# Altium schematic sheet Keypadmacro.SchDoc
size 419 x 297 mm
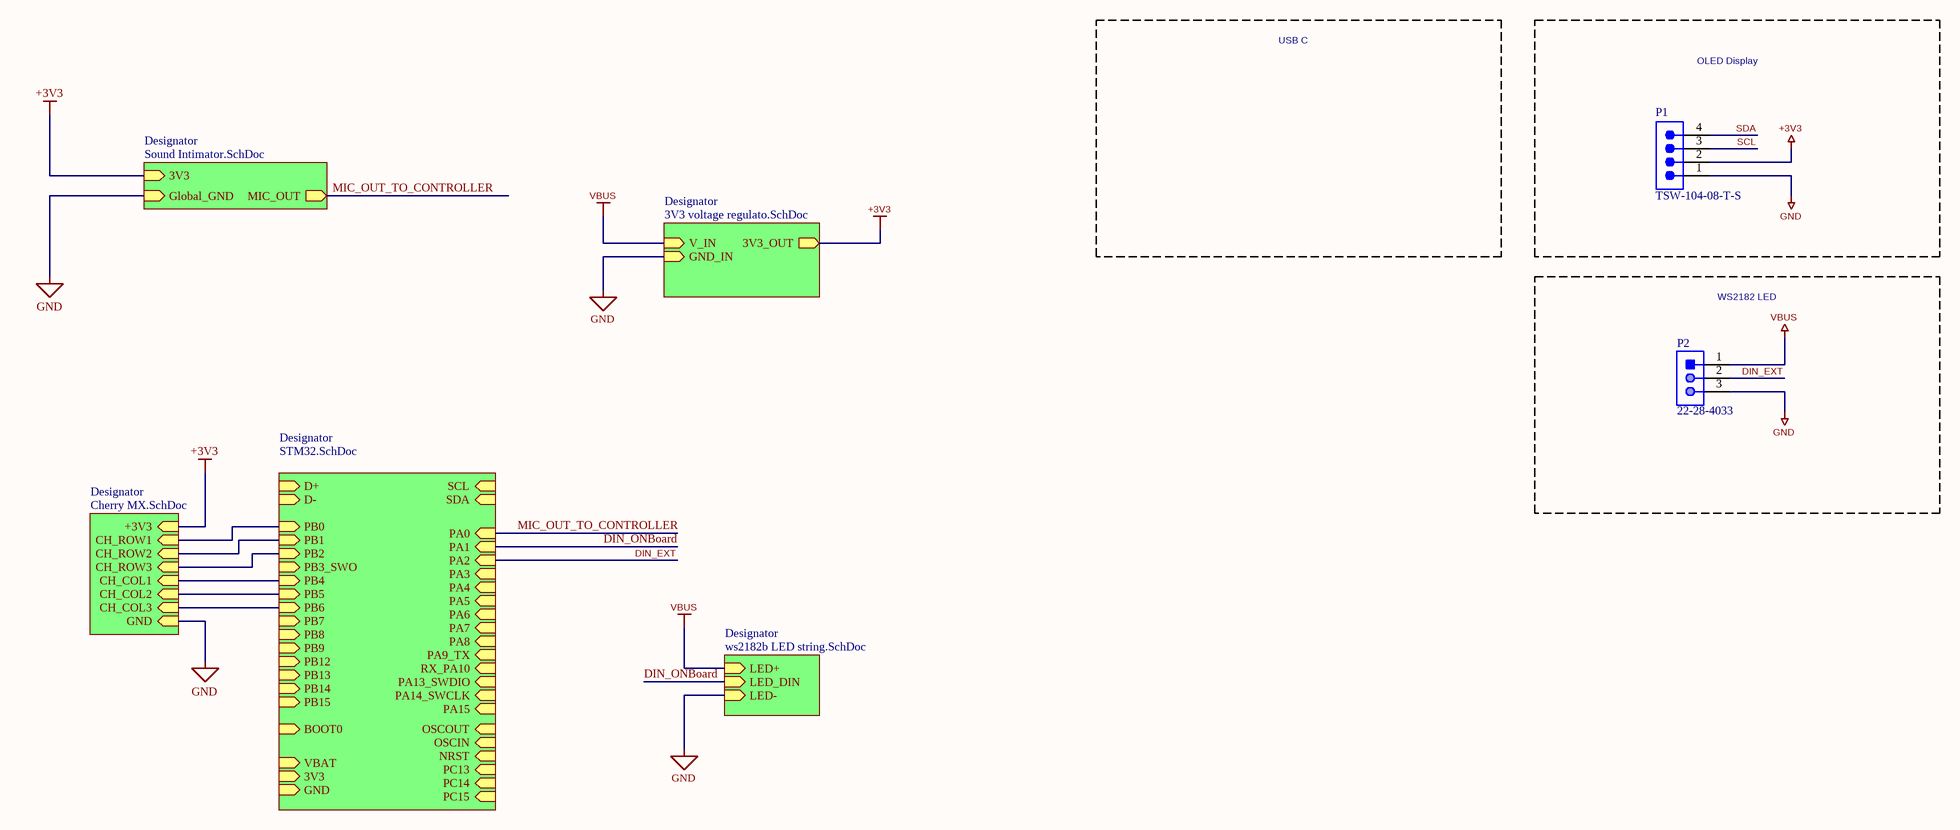
[diagram p0: Keypadmacro.SchDoc]

## Parts
P1  TSW-104-08-T-S  [SMTC-TSW-104-08-X-S]
P2  22-28-4033  [MOLX-22-28-4033_V]

## Blocks framed on the sheet
OLED Display: P1
WS2182 LED: P2

## Sub-sheets
Designator = Sound Intimator.SchDoc: 3V3 (in), Global_GND (in), MIC_OUT (out)
Designator = STM32.SchDoc: 3V3 (in), VBAT (in), GND (in), D+ (in), D- (in), BOOT0 (in), NRST (in), PA0 (in), PA9_TX (in), PA6 (in), PA7 (in), PA1 (in), PA5 (in), PA3 (in), PA2 (in), PA4 (in), PA8 (in), PB13 (in), PB6 (in), PB9 (in), PB12 (in), PB14 (in), PB0 (in), PB4 (in), PB3_SWO (in), PB1 (in), PB8 (in), PB15 (in), PB5 (in), PB2 (in), PB7 (in), RX_PA10 (in), PC14 (in), PC15 (in), PA15 (in), PC13 (in), SCL (in), OSCIN (in), SDA (in), PA13_SWDIO (in), PA14_SWCLK (in), OSCOUT (in)
Designator = Cherry MX.SchDoc: CH_ROW2 (in), CH_COL3 (in), CH_ROW3 (in), GND (in), +3V3 (in), CH_COL2 (in), CH_ROW1 (in), CH_COL1 (in)
Designator = 3V3 voltage regulato.SchDoc: 3V3_OUT (out), GND_IN (in), V_IN (in)
Designator = ws2182b LED string.SchDoc: LED+ (in), LED_DIN (in), LED- (in)

## Nets
+3V3: P1.2 ; sheet Designator/3V3, sheet Designator/+3V3, sheet Designator/3V3_OUT
GND: P1.1 P2.3 ; sheet Designator/Global_GND, sheet Designator/GND, sheet Designator/GND_IN, sheet Designator/LED-
VBUS: P2.1 ; sheet Designator/V_IN, sheet Designator/LED+
DIN_EXT: P2.2 ; sheet Designator/PA2
DIN_ONBoard: sheet Designator/PA1, sheet Designator/LED_DIN
MIC_OUT_TO_CONTROLLER: sheet Designator/MIC_OUT, sheet Designator/PA0
SCL: P1.3
SDA: P1.4
(unnamed): sheet Designator/PB6, sheet Designator/CH_COL3
(unnamed): sheet Designator/PB0, sheet Designator/CH_ROW1
(unnamed): sheet Designator/PB4, sheet Designator/CH_COL1
(unnamed): sheet Designator/PB1, sheet Designator/CH_ROW2
(unnamed): sheet Designator/PB5, sheet Designator/CH_COL2
(unnamed): sheet Designator/PB2, sheet Designator/CH_ROW3

## Notes on the sheet
- USB C
- 1
- 2
- 3
- 4
- 5
- 6
- 7
- 8
- A
- B
- C
- D
- E
- Title:
- File: Keypadmacro.sch
- Sheet: /
- F
- KiCad E.D.A.  kicad (5.1.4)-1
- Size: A3
- Date:
- Rev:
- Id: 1/4

## Library data of the parts
P1 = CMP-1024-00356-1: 0.025" SQ Post Header, Through-hole, Vertical, -55 to 105 degC, 2.54 mm Pitch, 4-Pin, Male, RoHS; Manufacturer: Samtec; Pitch: 2.54 mm; PackageDescription: .025[0.64] SQ. Post Terminal Strip Assembly; ComponentLink2URL: http://www.samtec.com/documents/webfiles/pdf/TSW_TH.PDF; ComponentLink3URL: http://www.samtec.com/documents/webfiles/cpdf/TSW-XXX-XX-XXX-X-XX-XXX-MKT.pdf; PackageVersion: DM, 8/1988; ComponentLink3Description: Package Specification; DatasheetVersion: F-214; Orientation: Vertical; RoHS: True; Mounting Technology: Through-hole; ComponentLink1URL: http://www.samtec.com; PartNumber: TSW-104-08-T-S; ComponentLink1Description: Manufacturer URL; Temperature Range: -55 to 105 degC; ComponentLink2Description: Datasheet; PackageReference: TSW-104-08-X-S
P2 = CMP-1676-00001-5: Male Header, Pitch 2.54 mm, 1 x 3 Position, Height 8.38 mm, Tail Length 3.18 mm, RoHS, Bulk; Manufacturer: Molex; Rows: 1; Voltage Rating: 250 V; Current Rating: 4 A; Min Operating Temperature: 0 degC; Lead Pitch: 0.1 inch; Packaging: Bulk; Contact Finish: Gold; RoHSCompliant: true; Contact Material: Brass; PackageReference: 22-28-4033; REACH SVHC: Unknown; PackageDescription: Male Header, Pitch 2.54 mm, 1 x 3 Position, Height 8.38 mm, Tail Length 3.18 mm; ComponentLink2URL: http://www.molex.com/pdm_docs/sd/022284033_sd.pdf; Height: 8.38 mm; Mounting Technology: Through Hole; ComponentLink1Description: Manufacturer URL; Length: 7.62 mm; Mount: Through Hole; DatasheetVersion: Rev. G, 01/2012; Max Operating Temperature: 75 degC; ComponentLink2Description: Datasheet; Colour: Black; Pins: 3; Contact Plating: Gold; Package Quantity: 1; ComponentLink1URL: http://www.molex.com/